# EAGLE design Uzebox Mini BW (EAGLE 5.06)
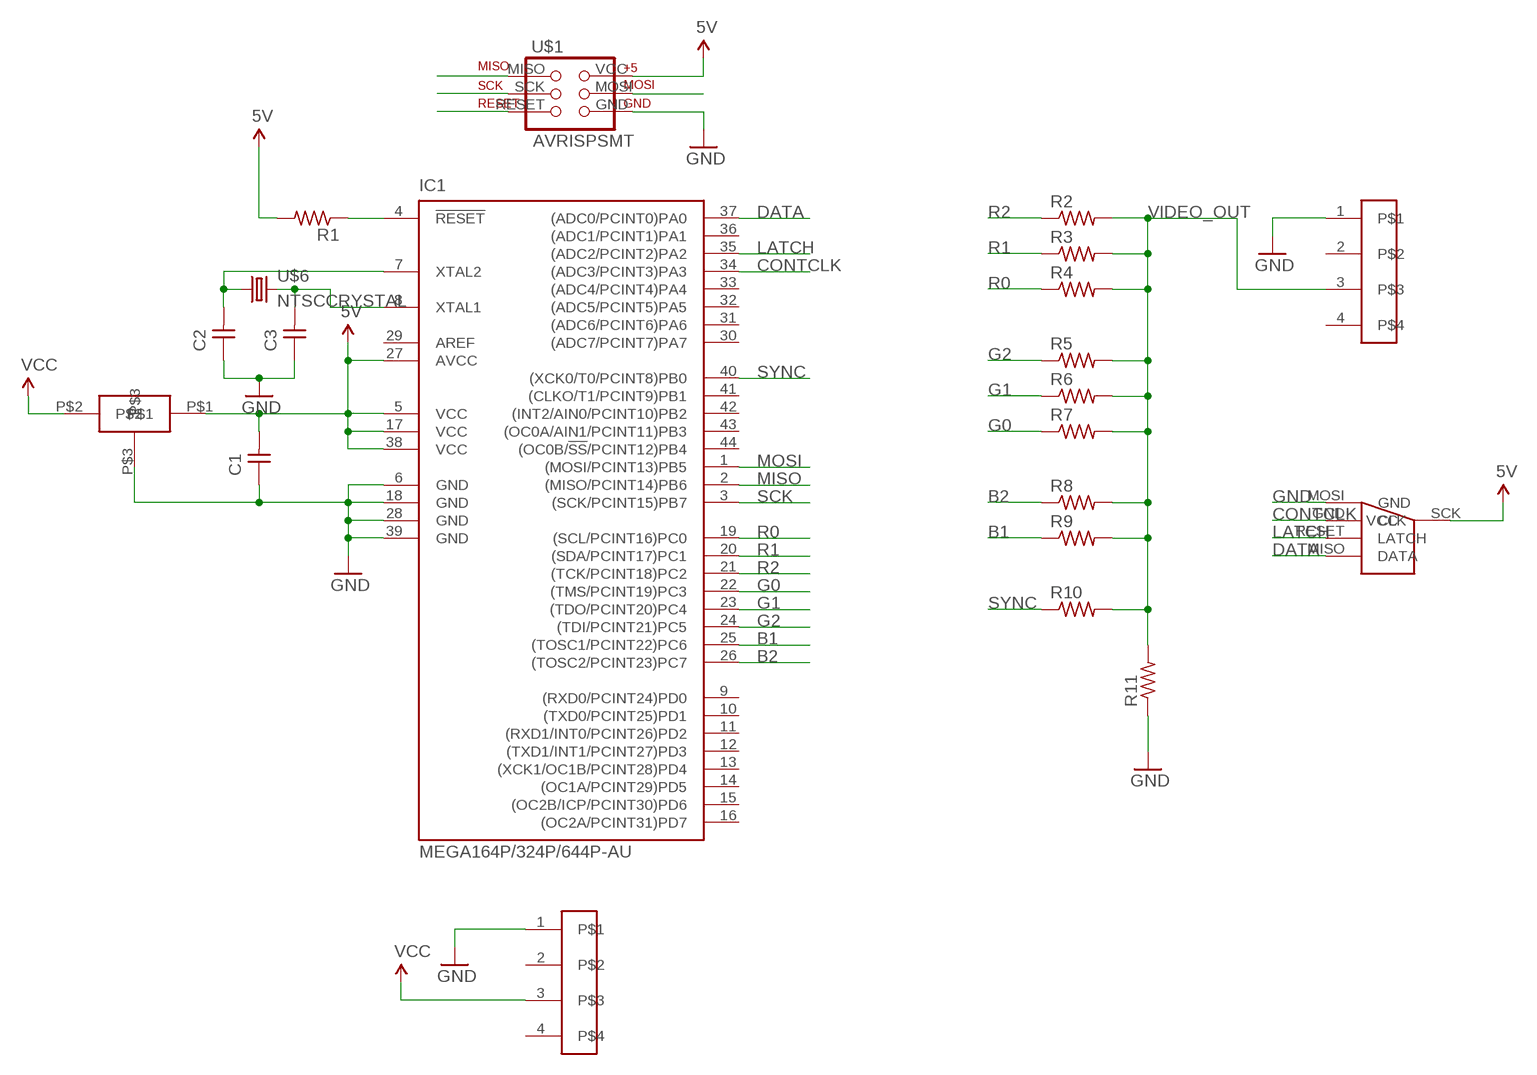
[diagram p0: schematic, sheet 1]

## Parts
C1  UNPOLARIZED_CAPACITOR1206  [1206]
C2  UNPOLARIZED_CAPACITOR1206  [1206]
C3  UNPOLARIZED_CAPACITOR1206  [1206]
IC1  MEGA164P/324P/644P-AU  MEGA164P/324P/644P-AUSMALLPADS  [TQFP44SMALLPADS]
R1  RESISTOR1206  [1206]
R2  RESISTOR1206  [1206]
R3  RESISTOR1206  [1206]
R4  RESISTOR1206  [1206]
R5  RESISTOR1206  [1206]
R6  RESISTOR1206  [1206]
R7  RESISTOR1206  [1206]
R8  RESISTOR1206  [1206]
R9  RESISTOR1206  [1206]
R10  RESISTOR1206  [1206]
R11  RESISTOR1206  [1206]
U$1  AVRISPSMT  [SMTAVRISP]
U$5  TINYREG  [SOT-23]
U$6  NTSCCRYSTAL  [NTSCCRYSTAL]
U$7  4PINSMTHEAD  [4PINSMTHEAD]
U$8  4PINSMTHEAD  [4PINSMTHEAD]
U$9  6PINNES  [SMTAVRISP]

## Nets
5V: C1.2 IC1.5(VCC) IC1.17(VCC) IC1.27(AVCC) IC1.38(VCC) R1.2 U$1.VCC U$5.P$1 U$9.SCK(VCC)
B1: IC1.25((TOSC1/PCINT22)PC6) R9.1
B2: IC1.26((TOSC2/PCINT23)PC7) R8.1
CONTCLK: IC1.34((ADC3/PCINT3)PA3) U$9.GND(CLK)
DATA: IC1.37((ADC0/PCINT0)PA0) U$9.MISO(DATA)
G0: IC1.22((TMS/PCINT19)PC3) R7.1
G1: IC1.23((TDO/PCINT20)PC4) R6.1
G2: IC1.24((TDI/PCINT21)PC5) R5.1
GND: C1.1 C2.1 C3.1 IC1.6(GND) IC1.18(GND) IC1.28(GND) IC1.39(GND) R11.1 U$1.GND U$5.P$3 U$7.1 U$8.1 U$9.MOSI(GND)
LATCH: IC1.35((ADC2/PCINT2)PA2) U$9.RESET(LATCH)
MISO: IC1.2((MISO/PCINT14)PB6) U$1.MISO
MOSI: IC1.1((MOSI/PCINT13)PB5) U$1.MOSI
N$2: C2.2 IC1.7(XTAL2) U$6.1
N$3: C3.2 IC1.8(XTAL1) U$6.3
R0: IC1.19((SCL/PCINT16)PC0) R4.1
R1: IC1.20((SDA/PCINT17)PC1) R3.1
R2: IC1.21((TCK/PCINT18)PC2) R2.1
RESET: IC1.4(!RESET) R1.1 U$1.RESET
SCK: IC1.3((SCK/PCINT15)PB7) U$1.SCK
SYNC: IC1.40((XCK0/T0/PCINT8)PB0) R10.1
VCC: U$5.P$2 U$7.3
VIDEO_OUT: R2.2 R3.2 R4.2 R5.2 R6.2 R7.2 R8.2 R9.2 R10.2 R11.2 U$8.3
Unconnected: IC1.9((RXD0/PCINT24)PD0) IC1.10((TXD0/PCINT25)PD1) IC1.11((RXD1/INT0/PCINT26)PD2) IC1.12((TXD1/INT1/PCINT27)PD3) IC1.13((XCK1/OC1B/PCINT28)PD4) IC1.14((OC1A/PCINT29)PD5) IC1.15((OC2B/ICP/PCINT30)PD6) IC1.16((OC2A/PCINT31)PD7) IC1.30((ADC7/PCINT7)PA7) IC1.31((ADC6/PCINT6)PA6) IC1.32((ADC5/PCINT5)PA5) IC1.33((ADC4/PCINT4)PA4) IC1.36((ADC1/PCINT1)PA1) IC1.41((CLKO/T1/PCINT9)PB1) IC1.42((INT2/AIN0/PCINT10)PB2) IC1.43((OC0A/AIN1/PCINT11)PB3) IC1.44((OC0B/!SS!/PCINT12)PB4) U$7.2 U$7.4 U$8.2 U$8.4

## Power pins joined to a net without a drawn wire
AREF: IC1.29(AREF)

## Library data of the parts
C1-C3 = ng:UNPOLARIZED_CAPACITOR: unpolarized_capacitor
IC1 = avr-6:MEGA164P/324P/644P-AU
R1-R11 = ng:RESISTOR
U$1 = david-lib:AVRISPSMT
U$5 = david-lib:TINYREG
U$6 = david-lib:NTSCCRYSTAL
U$7 U$8 = david-lib:4PINSMTHEAD
U$9 = david-lib:6PINNES

## Board
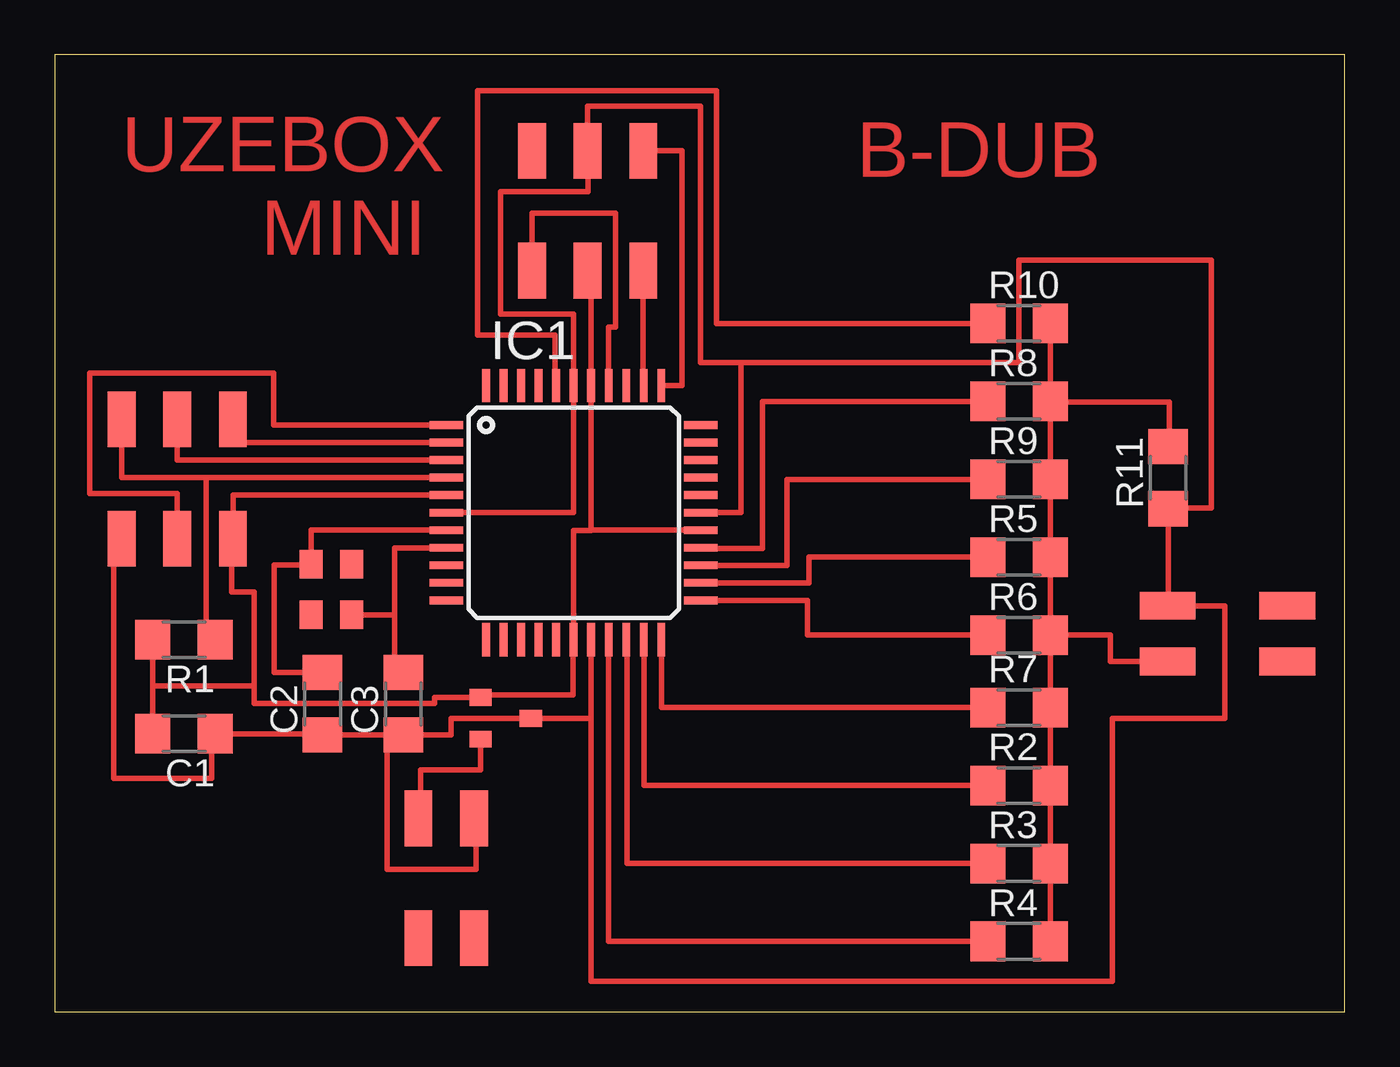
[diagram p1: board, top side]

Size 58.85 x 43.68 mm. Coordinates in mm from the lower left corner, seen from the top.
Outline: 0,0 58.85,0 58.85,43.68 0,43.68 0,0
Copper layers (1*16): Top 0.035mm / dielectric 1.5mm / Bottom 0.035mm
Design rules "default *": minimum track width 10mil, minimum drill 24mil, track to track 0.3962mm, track to pad 0.3962mm, pad to pad 0.3962mm, via to via 0.3962mm, smd to smd 8mil, copper to edge 40mil, drill to drill 8mil, minimum pad ring 10mil, minimum via ring 8mil, stop-mask expansion 4mil, vias tented up to drill 0mil, thermal gap 10mil

### Footprints (pad centres in the part's own frame; a part is rotated, then mirrored left to right if it is on the bottom)
1206 = smd 1.6 x 1.803: 1 -1.422,0; 2 1.422,0
TQFP44SMALLPADS = smd 1.524 x 0.356: 1 -5.8,4; 2 -5.8,3.2; 3 -5.8,2.4; 4 -5.8,1.6; 5 -5.8,0.8; 6 -5.8,0; 7 -5.8,-0.8; 8 -5.8,-1.6; 9 -5.8,-2.4; 10 -5.8,-3.2; 11 -5.8,-4; 23 5.8,-4; 24 5.8,-3.2; 25 5.8,-2.4; 26 5.8,-1.6; 27 5.8,-0.8; 28 5.8,0; 29 5.8,0.8; 30 5.8,1.6; 31 5.8,2.4; 32 5.8,3.2; 33 5.8,4 | smd 0.356 x 1.524: 12 -4,-5.8; 13 -3.2,-5.8; 14 -2.4,-5.8; 15 -1.6,-5.8; 16 -0.8,-5.8; 17 0,-5.8; 18 0.8,-5.8; 19 1.6,-5.8; 20 2.4,-5.8; 21 3.2,-5.8; 22 4,-5.8; 34 4,5.8; 35 3.2,5.8; 36 2.4,5.8; 37 1.6,5.8; 38 0.8,5.8; 39 0,5.8; 40 -0.8,5.8; 41 -1.6,5.8; 42 -2.4,5.8; 43 -3.2,5.8; 44 -4,5.8
SMTAVRISP = smd 1.27 x 2.54: GND 0,-5.46; MISO 5.08,0; MOSI 2.54,-5.46; RESET 0,0; SCK 2.54,0; VCC 5.08,-5.46
SOT-23 = smd 0.762 x 1.016: P$1 0,0; P$2 1.905,0; P$3 0.953,2.286
NTSCCRYSTAL = smd 1.3 x 1.05: 1 0,-1.85; 2 2.3,-1.85; 3 2.3,0; 4 0,0
4PINSMTHEAD = smd 1.27 x 2.54: 1 2.54,0; 2 2.54,-5.46; 3 0,0; 4 0,-5.46

### Placement (x,y rotation side)
C1  5.89,12.7 180 top
C2  12.22,14.07 90 top
C3  15.9,14.07 90 top
IC1  23.67,22.78 0 top
R1  5.89,16.99 180 top
R2  43.99,10.34 0 top
R3  43.99,6.78 0 top
R4  43.99,3.23 0 top
R5  43.99,20.75 0 top
R6  43.99,17.2 0 top
R7  43.99,13.89 0 top
R8  43.99,27.86 0 top
R9  43.99,24.31 0 top
R10  43.99,31.42 0 top
R11  50.8,24.38 90 top
U$1  3.05,27.05 0 top
U$5  19.43,14.35 270 top
U$6  13.54,20.42 270 top
U$7  16.59,8.84 0 top
U$8  50.77,16 90 top
U$9  26.85,33.83 180 top

### Tracks (layer width: path | path; a pad name or v marks a point on that pad's centre or on a via)
5V
  Top 0.254: U$9.SCK 24.31,32.66 24.46,32.66 IC1.38 24.47,21.97 | IC1.5 8.13,23.58 U$1.VCC | C1.2 4.47,14.99 | 4.47,14.99 R1.2 | U$1.VCC 8.15,21.59 | U$1.VCC 8.08,21.59 8.08,19.18 9.09,19.18 9.09,14.88 | 9.09,14.88 4.47,14.88 4.47,14.99 | 9.09,14.88 9.09,14.07 17.32,14.07 17.32,14.35 U$5.P$1 19.43,14.48 23.65,14.48 23.65,16.98 IC1.17 23.67,21.97 24.47,21.97 | IC1.27 24.47,21.98 24.47,21.97
B1
  Top 0.254: IC1.25 33.4,20.38 33.4,24.31 R9.1
B2
  Top 0.254: R8.1 32.28,27.86 32.28,21.16 29.47,21.16 IC1.26
CONTCLK
  Top 0.254: U$9.GND 28.63,39.29 28.63,28.57 IC1.34
DATA
  Top 0.254: IC1.37 | IC1.37 25.27,31.24 25.58,31.24 25.58,36.45 21.77,36.45 U$9.MISO
G0
  Top 0.254: R7.1 27.67,13.89 IC1.22
G1
  Top 0.254: IC1.23 34.34,18.78 34.34,17.2 R6.1
G2
  Top 0.254: IC1.24 34.42,19.58 34.42,20.75 R5.1
GND
  Top 0.254: 3.07,21.59 U$1.GND 2.69,21.59 2.69,10.67 7.16,10.67 7.16,12.7 C1.1 12.22,12.7 C2.1 15.16,12.65 | 15.16,12.65 C3.1 18.09,12.65 18.09,13.39 21.72,13.39 U$5.P$3 24.47,13.4 IC1.18 24.46,1.4 48.26,1.4 48.26,13.39 53.39,13.39 53.39,18.52 50.77,18.52 U$8.1 50.8,18.54 R11.1 50.8,22.99 52.76,22.99 52.76,34.31 43.99,34.31 43.99,29.64 31.32,29.64 | U$7.1 19.23,8.84 19.23,6.5 15.16,6.5 15.16,12.65 | IC1.28 31.32,22.78 31.32,29.64 | IC1.6 23.67,22.78 IC1.39 23.67,31.85 20.34,31.85 20.34,37.44 24.33,37.44 24.33,39.29 U$9.MOSI 24.31,41.33 29.46,41.33 29.46,29.64 31.32,29.64
LATCH
  Top 0.254: IC1.35 26.85,28.58 U$9.RESET
MISO
  Top 0.254: IC1.2 8.13,25.98 U$1.MISO
MOSI
  Top 0.254: IC1.1 9.98,26.78 9.98,29.16 1.6,29.16 1.6,23.65 5.59,23.65 U$1.MOSI
N$2
  Top 0.254: IC1.7 11.69,21.98 U$6.1 11.69,20.4 10.01,20.4 10.01,15.49 C2.2
N$3
  Top 0.254: U$6.3 15.49,18.12 | 15.49,18.12 15.49,21.18 IC1.8 | IC1.8 | C3.2 15.49,15.49 15.49,18.12
R0
  Top 0.254: R4.1 25.27,3.23 IC1.19
R1
  Top 0.254: IC1.20 26.11,16.98 26.11,6.78 R3.1
R2
  Top 0.254: IC1.21 | IC1.21 26.87,10.34 R2.1
RESET
  Top 0.254: 6.91,24.38 3.05,24.38 U$1.RESET | 6.91,24.38 IC1.4 | R1.1 6.91,16.99 6.91,24.38
SCK
  Top 0.254: IC1.3 5.59,25.18 U$1.SCK
SYNC
  Top 0.254: IC1.40 22.84,28.58 22.84,30.89 19.28,30.89 19.28,42.04 30.2,42.04 30.2,31.42 R10.1
VCC
  Top 0.254: U$7.3 16.69,8.84 16.69,11.05 19.43,11.05 U$5.P$2
VIDEO_OUT
  Top 0.254: R8.2 R10.2 | R8.2 R9.2 R5.2 R6.2 | R6.2 R7.2 R2.2 R3.2 R4.2 | U$8.3 48.16,16 48.16,17.2 R6.2 | R11.2 50.85,25.81 50.85,27.84 45.41,27.84 R8.2

### Text on the board
Top: UZEBOX | B-DUB | MINI